# Altium schematic sheet filtro salida gpio3.SchDoc
size A4
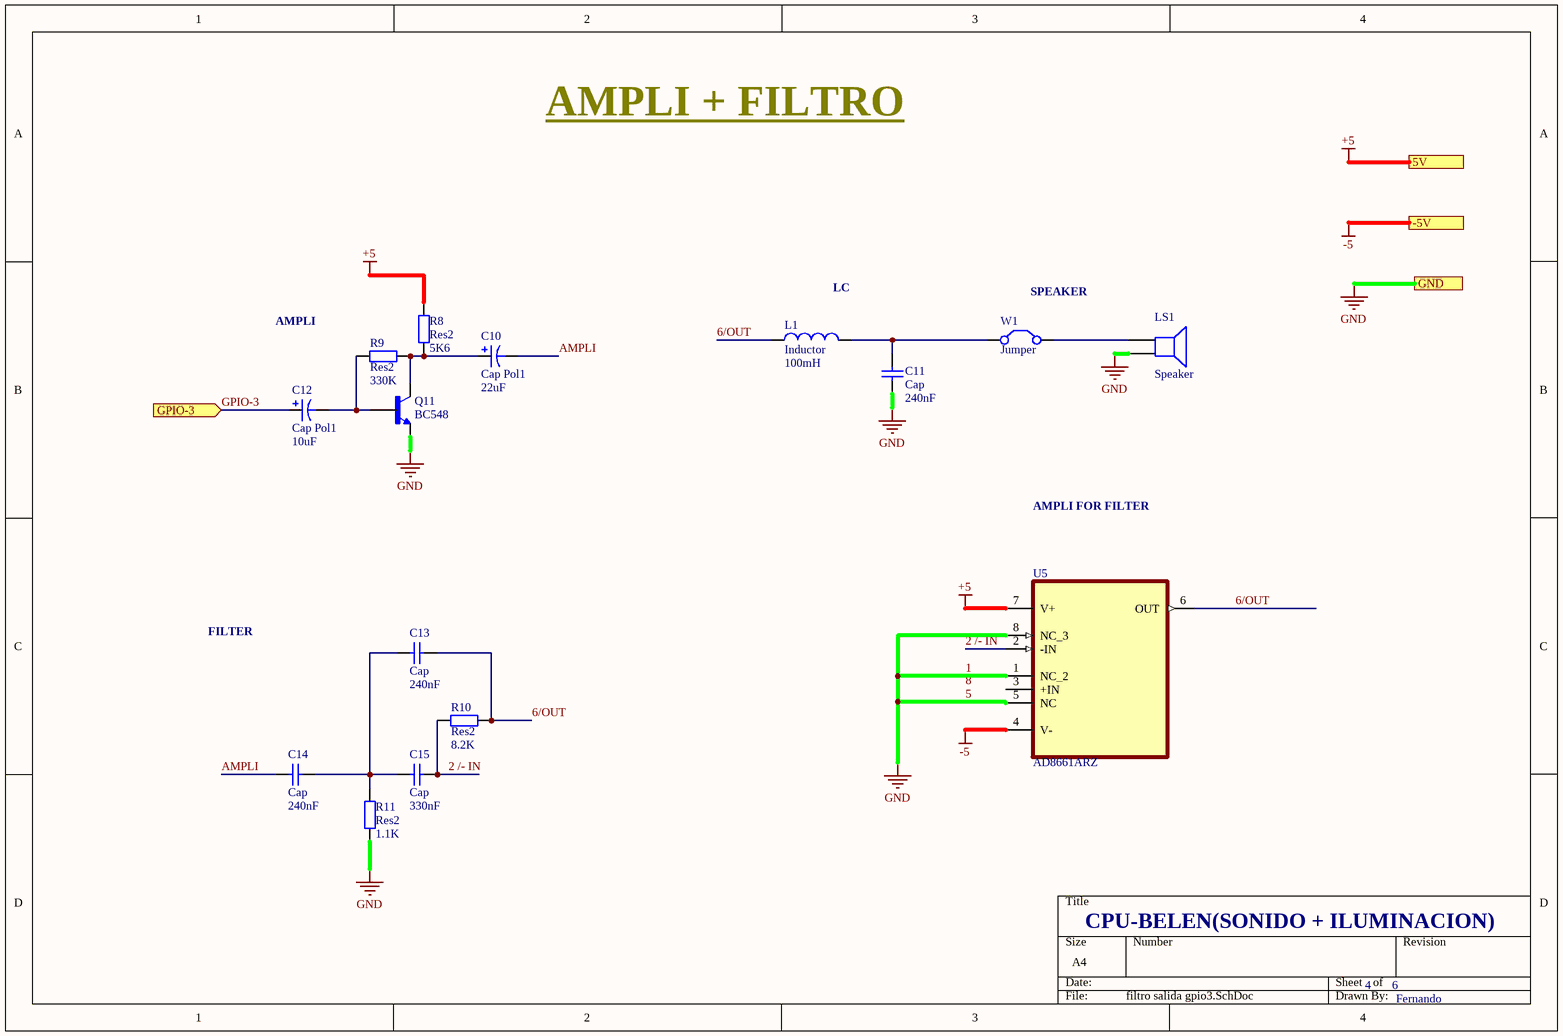
[diagram p0: filtro salida gpio3.SchDoc]

## Parts
C10  Cap Pol1  value 22uF  [RB7.6-15]
C11  Cap  value 240nF  [RAD-0.3]
C12  Cap Pol1  value 10uF  [RB7.6-15]
C13  Cap  value 240nF  [RAD-0.3]
C14  Cap  value 240nF  [RAD-0.3]
C15  Cap  value 330nF  [RAD-0.3]
L1  Inductor  value 100mH  [AXIAL-0.4]
LS1  Speaker  [PIN2]
Q11  BC548  [TO92127P520H533-3]
R8  Res2  value 5K6  [AXIAL-0.4]
R9  Res2  value 330K  [AXIAL-0.4]
R10  Res2  value 8.2K  [AXIAL-0.4]
R11  Res2  value 1.1K  [AXIAL-0.4]
U5  AD8661ARZ  [SOIC127P600X175-8N]
W1  Jumper  [RAD-0.2]

## Ports
5V, -5V, GND, GPIO-3 (in)

## Nets
1: C11.1 LS1.2 Q11.3(E) R11.1 U5.1(NC_2) U5.5(NC) U5.8(NC_3) ; port GND  [also labelled 5, GND]
+5: R8.2 U5.7(V+) ; port 5V
-5: U5.4(V-) ; port -5V
2 /- IN: C15.2 R10.1 U5.2(-IN)
6/OUT: C13.2 L1.1 R10.2 U5.6(OUT)
AMPLI: C10.2 C14.1
GPIO-3: C12.1 ; port GPIO-3
NetC10_1: C10.1 Q11.1(C) R8.1 R9.2
NetC11_2: C11.2 L1.2 W1.1(C1)
NetC12_2: C12.2 Q11.2(B) R9.1
NetC13_1: C13.1 C14.2 C15.1 R11.2
NetLS1_1: LS1.1 W1.2(C2)

Not connected (* = marked no-connect by the designer): U5 3(+IN)

## Notes on the sheet
- AMPLI + FILTRO
- (near L1) LC
- (near W1) SPEAKER
- AMPLI
- AMPLI FOR FILTER
- FILTER
- CPU-BELEN(SONIDO + ILUMINACION)
- 4
- 6
- Fernando
- Labels drawn without touching a wire or pin: 8

## Library data of the parts
C10 C12 = Cap Pol1: Polarized Capacitor (Radial); Published: 8-Jun-2000; LatestRevisionDate: 17-Jul-2002; LatestRevisionNote: Re-released for DXP Platform.; PackageReference: RB7.6-15; Publisher: Altium Limited; PackageDescription: Polarized Capacitor (Radial); 2 Leads
C11 C13-C15 = Cap: Capacitor; Published: 8-Jun-2000; LatestRevisionDate: 17-Jul-2002; LatestRevisionNote: Re-released for DXP Platform.; PackageReference: RAD-0.3; Publisher: Altium Limited; PackageDescription: Radial Cap, Thru-Hole; 2 Leads; 0.3 in Pin Spacing
L1 = Inductor: Code_IEC: 1005; Published: 8-Jun-2000; LatestRevisionDate: 29-May-2009; LatestRevisionNote: IPC-7351 Footprint Added.; PackageReference: 0402-A; Publisher: Altium Limited; PackageDescription: Chip Inductor; Code_JEITA: 0402
LS1 = Speaker: Loudspeaker; Published: 24-Mar-1999; LatestRevisionDate: 17-Jul-2002; LatestRevisionNote: Re-released for DXP Platform.; PackageReference: PIN2; Publisher: Altium Limited
Q11 = BC548: Bipolar (BJT) Transistor NPN 30V 100mA 300MHz 500mW Through Hole TO-92-3; MF: ON Semiconductor; DigiKey-Purchase-URL: https://snapeda.com/shop?store=DigiKey&id=2007035; MP: BC548; Availability: Warning; Package: TO-92 ON Semiconductor; Value: *; SnapEDA_Link: https://www.snapeda.com/parts/BC548/ON%20Semiconductor/view-part/2007035/?ref=snap; Price: None
R8-R11 = Res2: Resistor; Published: 8-Jun-2000; LatestRevisionDate: 17-Jul-2002; LatestRevisionNote: Re-released for DXP Platform.; PackageReference: AXIAL-0.4; Publisher: Altium Limited; PackageDescription: Axial Device, Thru-Hole; 2 Leads; 0.4 in Pin Spacing
U5 = AD8661ARZ: General Purpose Amplifier 1 Circuit Rail-to-Rail 8-SOIC; MF: Analog Devices; Value: *; Price: None; Package: SOIC-8 Analog Devices; Availability: In Stock; Purchase-URL: https://pricing.snapeda.com/search/part/AD8661ARZ/?ref=eda; MP: AD8661ARZ
W1 = Jumper: Jumper Wire; Published: 24-Mar-1999; LatestRevisionDate: 17-Jul-2002; LatestRevisionNote: Re-released for DXP Platform.; PackageReference: RAD-0.2; Publisher: Altium Limited; PackageDescription: Radial Cap, Thru-Hole; 2 Leads; 0.2 in Pin Spacing